# EAGLE schematic Peachy1-99-6-f (EAGLE 6.5.0)

## Sheet 1 of 4
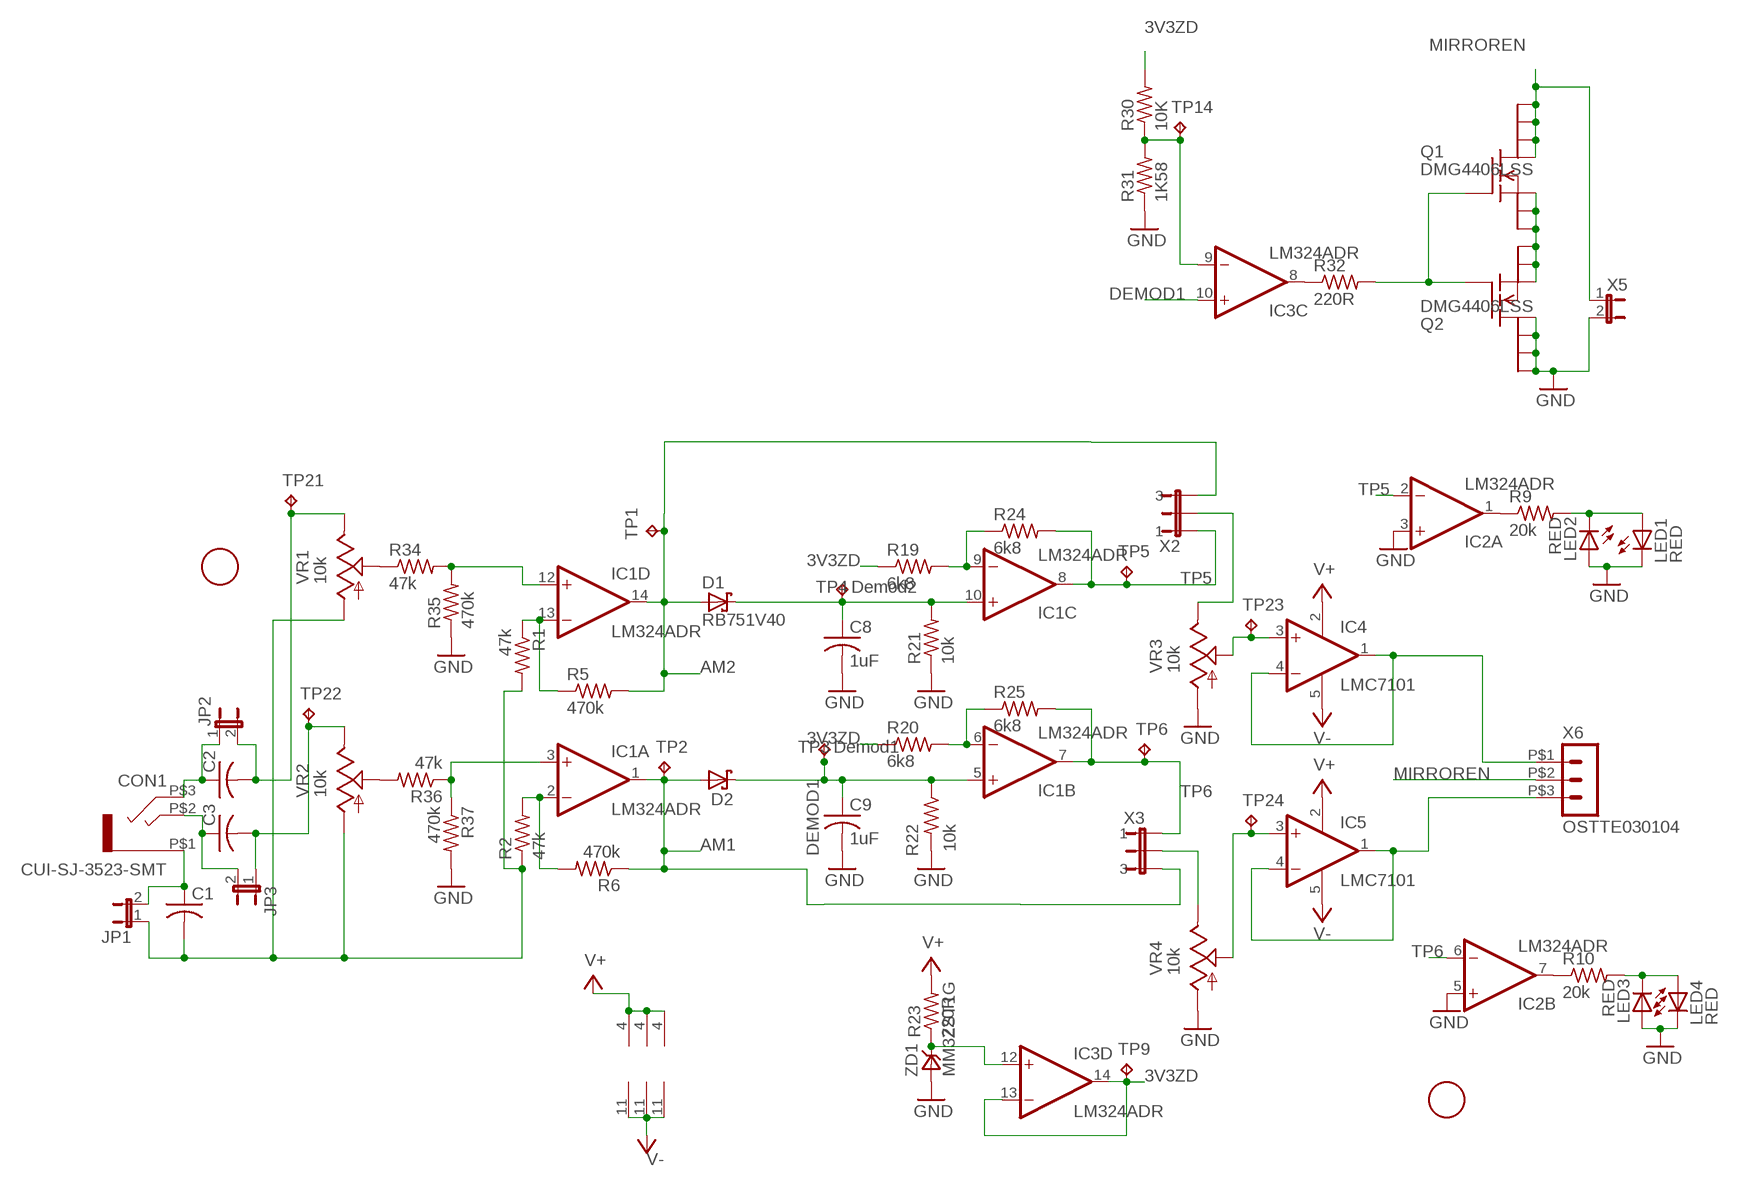
[diagram p0: schematic, sheet 1]

### Parts
C1  C-US0805  [C0805]
C2  C-US0805  [C0805]
C3  C-US0805  [C0805]
C8  1uF  C-US0805  [C0805]
C9  1uF  C-US0805  [C0805]
CON1  CUI-SJ-3523-SMT  [CUI-SJ-3523-SMT]
D1  RB751V40  [SOD323-R]
D2  RB751V40  [SOD323-R]
IC1  LM324ADR  [SOIC14(TI-PKG-D)]
IC2  LM324ADR  [SOIC14(TI-PKG-D)]
IC3  LM324ADR  [SOIC14(TI-PKG-D)]
IC4  LMC7101  [SOT23-5]
IC5  LMC7101  [SOT23-5]
JP1  JUMPER-2SMD-NC  [SJ_2S]
JP2  JUMPER-2SMD-NC  [SJ_2S]
JP3  JUMPER-2SMD-NC  [SJ_2S]
LED1  RED  LEDCHIPLED_0603  [CHIPLED_0603]
LED2  RED  LEDCHIPLED_0603  [CHIPLED_0603]
LED3  RED  LEDCHIPLED_0603  [CHIPLED_0603]
LED4  RED  LEDCHIPLED_0603  [CHIPLED_0603]
Q1  DMG4406LSS  [SO8_DMG]
Q2  DMG4406LSS  [SO8_DMG]
R1  47k  R-US_R0805  [R0805]
R2  47k  R-US_R0805  [R0805]
R5  470k  R-US_R0805  [R0805]
R6  470k  R-US_R0805  [R0805]
R9  20k  R-US_R0805  [R0805]
R10  20k  R-US_R0805  [R0805]
R19  6k8  R-US_R0805  [R0805]
R20  6k8  R-US_R0805  [R0805]
R21  10k  R-US_R0805  [R0805]
R22  10k  R-US_R0805  [R0805]
R23  220R  R-US_R0805  [R0805]
R24  6k8  R-US_R0805  [R0805]
R25  6k8  R-US_R0805  [R0805]
R30  10K  R-US_R0805  [R0805]
R31  1K58  R-US_R0805  [R0805]
R32  220R  R-US_R0805  [R0805]
R34  47k  R-US_R0805  [R0805]
R35  470k  R-US_R0805  [R0805]
R36  47k  R-US_R0805  [R0805]
R37  470k  R-US_R0805  [R0805]
TP1  TP017HOLE  [TP017TH]
TP2  TP017HOLE  [TP017TH]
TP3  TP017HOLE  [TP017TH]
TP4  TP017HOLE  [TP017TH]
TP5  TP017HOLE  [TP017TH]
TP6  TP017HOLE  [TP017TH]
TP9  TP017HOLE  [TP017TH]
TP14  TP017HOLE  [TP017TH]
TP21  TP017HOLE  [TP017TH]
TP22  TP017HOLE  [TP017TH]
TP23  TP017HOLE  [TP017TH]
TP24  TP017HOLE  [TP017TH]
U$2  FIDUCIAL  [FIDUCIAL_1MM]
U$3  FIDUCIAL  [FIDUCIAL_1MM]
VR1  10k  TRIM_US-67W  [67W]
VR2  10k  TRIM_US-67W  [67W]
VR3  10k  TRIM_US-PVZ3A  [PVZ3A]
VR4  10k  TRIM_US-PVZ3A  [PVZ3A]
X2  JUMPER-31-2  [SJ_3_PASTE1&2]
X3  JUMPER-31-2  [SJ_3_PASTE1&2]
X5  JUMPER-2SMD-NO  [SJ_2S-NO]
X6  OSTTE030104  [OSTTE030104]
ZD1  MM3ZST1G  [SOD323-R]

### Nets
3V3ZD: IC3.13(D:-IN) IC3.14(D:OUT) R19.1 R20.1 R30.2 TP9.P$1(TP) ; also sheet 3
AM1: D2.A IC1.1(A:OUT) R6.1 TP2.P$1(TP) X3.3 ; also sheet 3
AM2: D1.A IC1.14(D:OUT) R5.2 TP1.P$1(TP) X2.3
DEMOD1: C9.1 D2.C IC1.5(B:+IN) IC3.10(C:+IN) R22.1 TP3.P$1(TP)
DEMOD2: C8.1 D1.C IC1.10(C:+IN) R21.2 TP4.P$1(TP)
GND [pwr]: C8.2 C9.2 IC2.3(A:+IN) IC2.5(B:+IN) LED1.C LED2.A LED3.A LED4.C Q2.P$5(D) Q2.P$6(D) Q2.P$7(D) Q2.P$8(D) R21.1 R22.2 R31.1 R35.1 R37.2 VR3.P$1(A) VR4.P$1(A) X5.2 ZD1.A ; also sheet 2,3,4
MIRROREN [pwr]: Q1.P$5(D) Q1.P$6(D) Q1.P$7(D) Q1.P$8(D) X5.1 X6.P$2
N$3: C3.2 JP3.1 TP22.P$1(TP) VR2.E
N$4 [pwr]: C1.2 JP1.1 R1.2 R2.1 VR1.A VR2.A
N$5: R34.1 VR1.S
N$6: IC1.13(D:-IN) R1.1 R5.1
N$8: IC1.12(D:+IN) R34.2 R35.2
N$9: VR4.P$3(E) X3.2
N$10: IC3.12(D:+IN) R23.1 ZD1.C
N$12: IC1.2(A:-IN) R2.2 R6.2
N$13: IC4.3(+IN) TP23.P$1(TP) VR3.P$2(S)
N$14: R36.2 VR2.S
N$15: IC1.3(A:+IN) R36.1 R37.1
N$17: IC1.9(C:-IN) R19.2 R24.1
N$18: IC2.1(A:OUT) R9.1
N$19: IC1.6(B:-IN) R20.2 R25.1
N$20: IC2.7(B:OUT) R10.1
N$21 [pwr]: IC5.1(OUT) IC5.4(-IN) X6.P$3
N$22 [pwr]: IC4.1(OUT) IC4.4(-IN) X6.P$1
N$23: VR3.P$3(E) X2.2
N$24: IC5.3(+IN) TP24.P$1(TP) VR4.P$2(S)
N$28: Q1.P$4(G) Q2.P$4(G) R32.2
N$32: Q1.P$1(S) Q1.P$2(S) Q1.P$3(S) Q2.P$1(S) Q2.P$2(S) Q2.P$3(S)
N$38: IC3.9(C:-IN) R30.1 R31.2 TP14.P$1(TP)
N$39: LED1.A LED2.C R9.2
N$42: IC3.8(C:OUT) R32.1
N$44: LED3.C LED4.A R10.2
N$51: C1.1 CON1.P$1 JP1.2
N$52: C3.1 CON1.P$2 JP3.2
N$53: C2.1 CON1.P$3 JP2.1
N$54: C2.2 JP2.2 TP21.P$1(TP) VR1.E
TP5: IC1.8(C:OUT) IC2.2(A:-IN) R24.2 TP5.P$1(TP) X2.1
TP6: IC1.7(B:OUT) IC2.6(B:-IN) R25.2 TP6.P$1(TP) X3.1
V+: IC1.4(P:V+) IC2.4(P:V+) IC3.4(P:V+) IC4.2(V+) IC5.2(V+) R23.2 ; also sheet 2,3
V-: IC1.11(P:V-) IC2.11(P:V-) IC3.11(P:V-) IC4.5(V-) IC5.5(V-) ; also sheet 2
Unconnected: IC2.12(D:+IN) IC2.13(D:-IN) IC2.14(D:OUT)

## Sheet 2 of 4: Power Supply
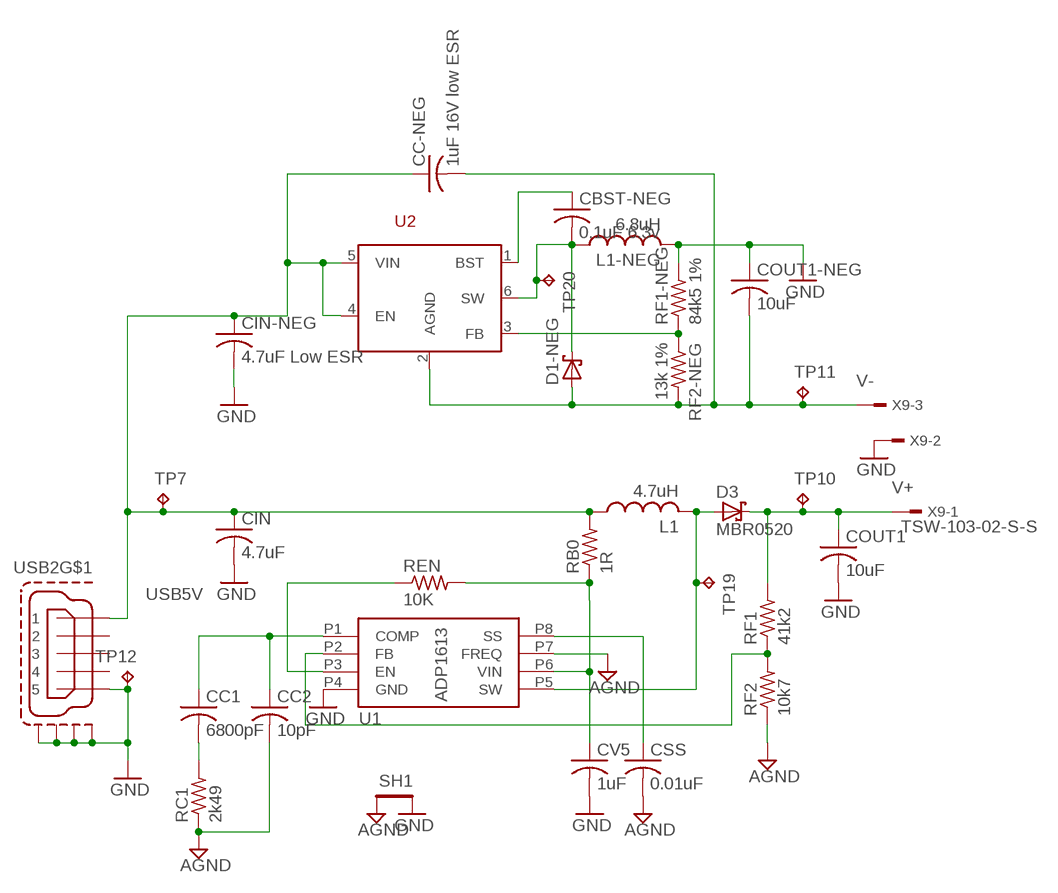
[diagram p1: schematic, sheet 2]

### Parts
CBST-NEG  0.1uF 6.3v  C-US0805  [C0805]
CC1  6800pF  C-US0805  [C0805]
CC2  10pF  C-US0805  [C0805]
CC-NEG  1uF 16V low ESR  C-US0805  [C0805]
CIN  4.7uF  C-US0805  [C0805]
CIN-NEG  4.7uF Low ESR  C-US0805  [C0805]
COUT1  10uF  C-US0805  [C0805]
COUT1-NEG  10uF  C-US0805  [C0805]
CSS  0.01uF  C-US0805  [C0805]
CV5  1uF  C-US0805  [C0805]
D1-NEG  MBR0520LT1G  SCHOTTKYSOD123  [SOD123]
D3  MBR0520  SCHOTTKYSOD123  [SOD123]
L1  4.7uH  L-USL1210  [L1210]
L1-NEG  6.8uH  L-USL1210  [L1210]
RB0  1R  R-US_R0805  [R0805]
RC1  2k49  R-US_R0805  [R0805]
REN  10K  R-US_R0805  [R0805]
RF1  41k2  R-US_R0805  [R0805]
RF1-NEG  84k5 1%  R-US_R0805  [R0805]
RF2  10k7  R-US_R0805  [R0805]
RF2-NEG  13k 1%  R-US_R0805  [R0805]
SH1  SHORT-HT5  [SHORT_TOP-50]
TP7  TP017HOLE  [TP017TH]
TP10  TP017HOLE  [TP017TH]
TP11  TP017HOLE  [TP017TH]
TP12  TP017HOLE  [TP017TH]
TP19  TP017HOLE  [TP017TH]
TP20  TP017HOLE  [TP017TH]
U1  ADP1613  [RM-8]
U2  ADP2300  [TSOT23-6]
USB2  FCI-MICROUSBAPCIRCUITS  [FCI-USB-10118193-APCIRCUITS]
X9  TSW-103-02-S-S  [TSW-103-02-S-S]

### Nets
AGND [pwr]: CC2.2 CSS.2 RC1.1 RF2.1 SH1.1 U1.P7(FREQ)
BOOST: CBST-NEG.1 U2.1(BST)
GND [pwr]: CIN-NEG.2 CIN.2 COUT1-NEG.1 COUT1.2 CV5.2 L1-NEG.2 RF1-NEG.2 SH1.2 TP12.P$1(TP) U1.P4(GND) USB2.P$5 USB2.P$6(S1) USB2.P$7(S2) USB2.P$8(S3) USB2.P$11(S4) X9.2 ; also sheet 1,3,4
N$1: CV5.1 RB0.1 REN.2 U1.P6(VIN)
N$2: REN.1 U1.P3(EN)
N$16: CSS.1 U1.P8(SS)
N$34: RF1.1 RF2.2 U1.P2(FB)
N$35: CC1.1 CC2.1 U1.P1(COMP)
N$36: CC1.2 RC1.2
N$40: RF1-NEG.1 RF2-NEG.1 U2.3(FB)
SW+: D3.A L1.2 TP19.P$1(TP) U1.P5(SW)
SW-: CBST-NEG.2 D1-NEG.C L1-NEG.1 TP20.P$1(TP) U2.6(SW)
USB5V [pwr]: CC-NEG.1 CIN-NEG.1 CIN.1 L1.1 RB0.2 TP7.P$1(TP) U2.4(EN) U2.5(VIN) USB2.P$1
V+: COUT1.1 D3.C RF1.2 TP10.P$1(TP) X9.1 ; also sheet 1,3
V-: CC-NEG.2 COUT1-NEG.2 D1-NEG.A RF2-NEG.2 TP11.P$1(TP) U2.2(AGND) X9.3 ; also sheet 1
Unconnected: USB2.P$2 USB2.P$3 USB2.P$4

## Sheet 3 of 4: Laser Control
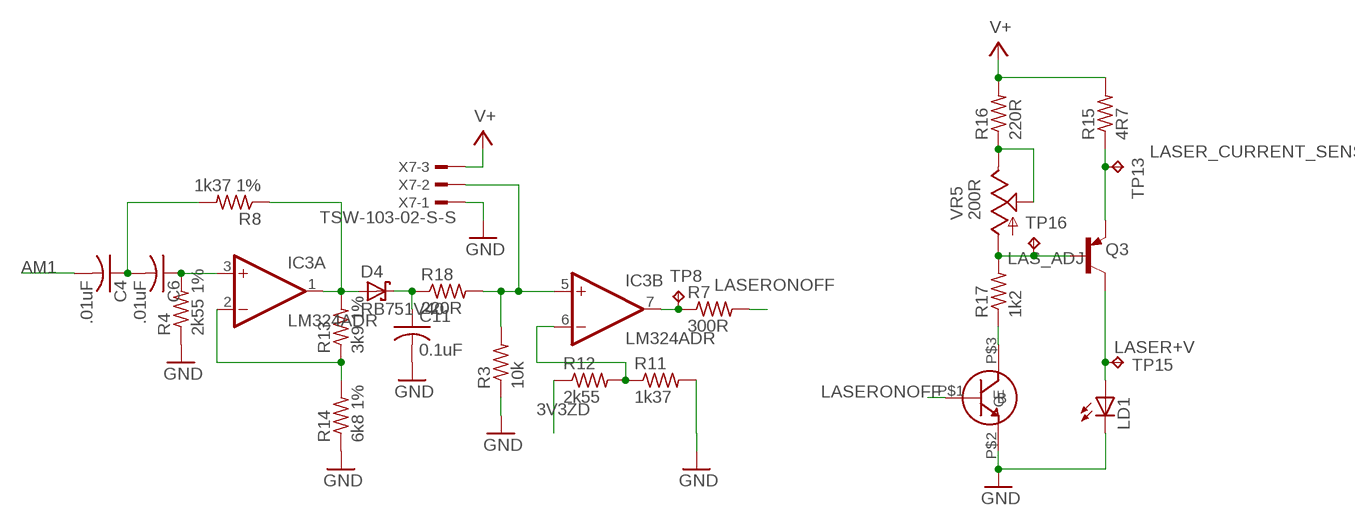
[diagram p2: schematic, sheet 3]

### Parts
C4  .01uF  C-US0805  [C0805]
C6  .01uF  C-US0805  [C0805]
C11  0.1uF  C-US0805  [C0805]
D4  RB751V40  [SOD323-R]
LD1  LASERDIODELD2  [LASERDIODE2]
Q3  BC857CT  [SC-75]
Q4  MMBT3904  [SOT23]
R3  10k  R-US_R0805  [R0805]
R4  2k55 1%  R-US_R0805  [R0805]
R7  300R  R-US_R0805  [R0805]
R8  1k37 1%  R-US_R0805  [R0805]
R11  1k37  R-US_R0805  [R0805]
R12  2k55  R-US_R0805  [R0805]
R13  3k9 1%  R-US_R0805  [R0805]
R14  6k8 1%  R-US_R0805  [R0805]
R15  4R7  R-US_R0805  [R0805]
R16  220R  R-US_R0805  [R0805]
R17  1k2  R-US_R0805  [R0805]
R18  220R  R-US_R0805  [R0805]
TP8  TP017HOLE  [TP017TH]
TP13  TP017HOLE  [TP017TH]
TP15  TP017HOLE  [TP017TH]
TP16  TP017HOLE  [TP017TH]
VR5  200R  TRIM_US-TC33X  [TC33X]
X7  TSW-103-02-S-S  [TSW-103-02-S-S]

### Nets
3V3ZD: R12.1 ; also sheet 1
AM1: C4.2 ; also sheet 1
GND [pwr]: C11.2 LD1.P$3(C) Q4.P$2(E) R3.1 R4.1 R11.2 R14.1 X7.1 ; also sheet 1,2,4
LASERONOFF: Q4.P$1(B) R7.2
N$7: IC3.5(B:+IN) R3.2 R18.2 X7.2
N$11: IC3.6(B:-IN) R11.1 R12.2
N$25: IC3.2(A:-IN) R13.1 R14.2
N$26: LD1.P$1(A) Q3.P$3(C) TP15.P$1(TP)
N$27: IC3.7(B:OUT) R7.1 TP8.P$1(TP)
N$29: C6.1 IC3.3(A:+IN) R4.2
N$30: C4.1 C6.2 R8.2
N$31: D4.A IC3.1(A:OUT) R8.1 R13.2
N$33: C11.1 D4.C R18.1
N$37: R16.1 VR5.P$2(S) VR5.P$3(E)
N$45: Q3.P$1(B) R17.2 TP16.P$1(TP) VR5.P$1(A)
N$46: Q4.P$3(C) R17.1
N$49: Q3.P$2(E) R15.1 TP13.P$1(TP)
V+: R15.2 R16.2 X7.3 ; also sheet 1,2

## Sheet 4 of 4: Depth Sensor
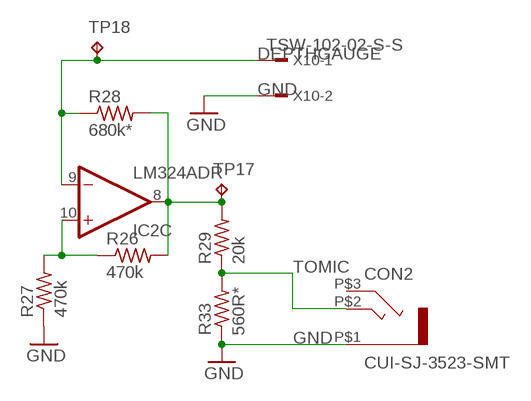
[diagram p3: schematic, sheet 4]

### Parts
CON2  CUI-SJ-3523-SMT  [CUI-SJ-3523-SMT]
R26  470k  R-US_R0805  [R0805]
R27  470k  R-US_R0805  [R0805]
R28  680k*  R-US_SOCKET(.1)  [70543-02]
R29  20k  R-US_R0805  [R0805]
R33  560R*  R-US_R0805  [R0805]
TP17  TP017HOLE  [TP017TH]
TP18  TP017HOLE  [TP017TH]
X10  TSW-102-02-S-S  [TSW-102-02-S-S]

### Nets
DEPTHGAUGE: IC2.9(C:-IN) R28.1 TP18.P$1(TP) X10.1
GND [pwr]: CON2.P$1 R27.1 R33.1 X10.2 ; also sheet 1,2,3
N$47: IC2.8(C:OUT) R26.2 R28.2 R29.2 TP17.P$1(TP)
N$48: IC2.10(C:+IN) R26.1 R27.2
TOMIC: CON2.P$2 R29.1 R33.2
Unconnected: CON2.P$3

## Library data of the parts
C1-C3 = Scott:C-US: CAPACITOR, American symbol
C4 C6 CSS = Scott:C-US: CAPACITOR, American symbol; MPN: CL21B103KBANNNC
C8 C9 CC-NEG CV5 = Scott:C-US: CAPACITOR, American symbol; MPN: CL21B105KBFNNNE
C11 CBST-NEG = Scott:C-US: CAPACITOR, American symbol; MPN: CL21B104KACNNNC
CC1 = Scott:C-US: CAPACITOR, American symbol; MPN: CL21B682KBANNNC
CC2 = Scott:C-US: CAPACITOR, American symbol; MPN: CL21C100JCANNNC
CIN CIN-NEG = Scott:C-US: CAPACITOR, American symbol; MPN: CL21A475KOFNNNE
CON1 CON2 = Scott:CUI-SJ-3523-SMT; MPN: SJ-3523-SMT-TR
COUT1 COUT1-NEG = Scott:C-US: CAPACITOR, American symbol; MPN: CL21B106KQQNNNE
D1 D2 D4 = Scott:RB751; MPN: RB751V40,115
D1-NEG D3 = Scott:SCHOTTKY; MPN: MBR0520LT3G
IC1-IC3 = Scott:LM324: OP AMP; MPN: LM324ADR
IC4 IC5 = Scott:LMC7101; MPN: LMC7101BYM5
JP1-JP3 X5 = Scott:JUMPER-2: Jumper Basic 0.1" spaced jumper. Use with breakaway headers.
L1 = Scott:L-US: INDUCTOR, American symbol; MPN: LQH32PN4R7NN0L
L1-NEG = Scott:L-US: INDUCTOR, American symbol; MPN: LQH32PN6R8NN0
LD1 = Scott:LASERDIODE; MPN: 3 x (0552-2-15-15-11-27-10-0)
LED1-LED4 = Scott:LED: LED OSRAM: - CHIPLED LG R971, LG N971, LY N971, LG Q971, LY Q971, LO R971, LY R971 LH N974, LH R974 LS Q976, LO Q976, LY Q976 LO Q996 - Hyper CHIPLED LW Q18S LB Q993, LB Q99A, LB R99A - SideLED LS A670, LO A670, LY A670, LG A670, LP A670 LB A673, LV A673, LT A673, LW A673 LH A674 LY A675 LS A676, LA A676, LO A676, LY A676, LW A676 LS A679, LY A679, LG A679 - Hyper Micro SIDELED® LS Y876, LA Y876, LO Y876, LY Y876 LT Y87S - SmartLED LW L88C, LW L88S LB L89C, LB L89S, LG L890 LS L89K, LO L89K, LY L89K LS L896, LA L896, LO L896, LY L896 - TOPLED LS T670, LO T670, LY T670, LG T670, LP T670 LSG T670, LSP T670, LSY T670, LOP T670, LYG T670 LG T671, LOG T671, LSG T671 LB T673, LV T673, LT T673, LW T673 LH T674 LS T676, LA T676, LO T676, LY T676, LB T676, LH T676, LSB T676, LW T676 LB T67C, LV T67C, LT T67C, LS T67K, LO T67K, LY T67K, LW E67C LS E67B, LA E67B, LO E67B, LY E67B, LB E67C, LV E67C, LT E67C LW T67C LS T679, LY T679, LG T679 LS T770, LO T770, LY T770, LG T770, LP T770 LB T773, LV T773, LT T773, LW T773 LH T774 LS E675, LA E675, LY E675, LS T675 LS T776, LA T776, LO T776, LY T776, LB T776 LHGB T686 LT T68C, LB T68C - Hyper Mini TOPLED® LB M676 - Mini TOPLED Santana® LG M470 LS M47K, LO M47K, LY M47K Source: http://www.osram.convergy.de LUXEON: - LUMILED® LXK2-PW12-R00, LXK2-PW12-S00, LXK2-PW14-U00, LXK2-PW14-V00 LXK2-PM12-R00, LXK2-PM12-S00, LXK2-PM14-U00 LXK2-PE12-Q00, LXK2-PE12-R00, LXK2-PE12-S00, LXK2-PE14-T00, LXK2-PE14-U00 LXK2-PB12-K00, LXK2-PB12-L00, LXK2-PB12-M00, LXK2-PB14-N00, LXK2-PB14-P00, LXK2-PB14-Q00 LXK2-PR12-L00, LXK2-PR12-M00, LXK2-PR14-Q00, LXK2-PR14-R00 LXK2-PD12-Q00, LXK2-PD12-R00, LXK2-PD12-S00 LXK2-PH12-R00, LXK2-PH12-S00 LXK2-PL12-P00, LXK2-PL12-Q00, LXK2-PL12-R00 Source: www.luxeon.com KINGBRIGHT: KA-3528ASYC Source: www.kingbright.com; MPN: LS L29K-G1J2-1-Z
Q1 Q2 = Scott:DMG4406LSS; MPN: DMG4406LSS-13
Q3 = Scott:BC857CT; MPN: BC857CT,115
Q4 = Scott:MMBT3904; MPN: MMBT3904,215
R1 R2 R34 R36 = Scott:R-US_: RESISTOR, American symbol; DIGIKEY: RMCF0805JT47K0CT-ND; MPN: RMCF0805JT47K0
R3 R21 R22 R30 REN = Scott:R-US_: RESISTOR, American symbol; MPN: RMCF0805JT10K0
R4 R12 = Scott:R-US_: RESISTOR, American symbol; MPN: RC0805FR-072K55L
R5 R6 R26 R27 R35 R37 = Scott:R-US_: RESISTOR, American symbol; MPN: RMCF0805JT470K
R7 = Scott:R-US_: RESISTOR, American symbol; MPN: RC0805JR-07300RL
R8 R11 = Scott:R-US_: RESISTOR, American symbol; MPN: RC0805FR-071K37L
R9 R10 R29 = Scott:R-US_: RESISTOR, American symbol; MPN: RMCF0805JT20K0
R13 = Scott:R-US_: RESISTOR, American symbol; MPN: RC0805FR-073K9L
R14 R19 R20 R24 R25 = Scott:R-US_: RESISTOR, American symbol; MPN: RC0805FR-076K8L
R15 = Scott:R-US_: RESISTOR, American symbol; MPN: RMCF0805JT4R70
R16 = Scott:R-US_: RESISTOR, American symbol; MPN: RC0805JR-07220RL
R17 = Scott:R-US_: RESISTOR, American symbol; MPN: RC2012J122CS
R18 R23 R32 = Scott:R-US_: RESISTOR, American symbol; MPN: RMCF0805JT220R
R28 = Scott:R-US_: RESISTOR, American symbol; MPN: PPTC021LFBN-RC
R31 = Scott:R-US_: RESISTOR, American symbol; MPN: RC0805FR-071K58L
R33 = Scott:R-US_: RESISTOR, American symbol; MPN: RMCF0805JT560R
RB0 = Scott:R-US_: RESISTOR, American symbol; MPN: RMCF0805JT1R00
RC1 = Scott:R-US_: RESISTOR, American symbol; MPN: RMCF0805FT2K49
RF1 = Scott:R-US_: RESISTOR, American symbol; MPN: RC0805FR-0741K2L
RF1-NEG = Scott:R-US_: RESISTOR, American symbol; MPN: RC0805FR-0784K5L
RF2 = Scott:R-US_: RESISTOR, American symbol; MPN: RC2012F1072CS
RF2-NEG = Scott:R-US_: RESISTOR, American symbol; MPN: RC0805FR-0713KL
SH1 = Scott:SHORT-H: Short between two nets; BOM: no
TP1 = Scott:TP: Test pad; TP_SIGNAL_NAME: Preamp2
TP2 = Scott:TP: Test pad; TP_SIGNAL_NAME: Preamp1
TP3 = Scott:TP: Test pad; TP_SIGNAL_NAME: Demod1
TP4 = Scott:TP: Test pad; TP_SIGNAL_NAME: Demod2
TP5 = Scott:TP: Test pad; TP_SIGNAL_NAME: TP5
TP6 = Scott:TP: Test pad; TP_SIGNAL_NAME: TP6
TP7-TP9 TP12 TP14 TP17 TP18 TP20-TP24 = Scott:TP: Test pad
TP10 = Scott:TP: Test pad; TP_SIGNAL_NAME: +V
TP11 = Scott:TP: Test pad; TP_SIGNAL_NAME: V-
TP13 = Scott:TP: Test pad; TP_SIGNAL_NAME: LASER_CURRENT_SENSE
TP15 = Scott:TP: Test pad; TP_SIGNAL_NAME: LASER+V
TP16 = Scott:TP: Test pad; TP_SIGNAL_NAME: LAS_ADJ
TP19 = Scott:TP: Test pad; TP_SIGNAL_NAME: SW+
U1 = Scott:ADP1613; MPN: ADP1613ARMZ-R7
U2 = Scott:ADP2300: Nonsynchronous Step-Down Regulator; MPN: ADP2300AUJZ-R7
U$2 U$3 = Scott:FIDUCIAL: For use by pick and place machines to calibrate the vision/machine, 1mm By microbuilder.eu
USB2 = Scott:FCI-MICROUSB; MPN: 10118193-0001LF
VR1 VR2 = Scott:TRIM_US-: POTENTIOMETER 3mm SMD Trimpot muRata PVZ3A/H/G (not K); MPN: 67WR10KLF
VR3 VR4 = Scott:TRIM_US-: POTENTIOMETER 3mm SMD Trimpot muRata PVZ3A/H/G (not K); MPN: PVZ3A103C01R00
VR5 = Scott:TRIM_US-: POTENTIOMETER 3mm SMD Trimpot muRata PVZ3A/H/G (not K); MPN: ???
X2 X3 = Scott:JUMPER-3
X6 = Scott:OSTTE030104; MPN: OSTTE030104; NOTE: Try 1984976
X7 X9 = Scott:TSW-103-02-S-S: THROUGH-HOLE .025" SQ POST HEADER Source: Samtec TSW.pdf; MPN: TSW-103-07-T-S; OC_FARNELL: unknown; OC_NEWARK: unknown
X10 = Scott:TSW-102-02-S-S: THROUGH-HOLE .025" SQ POST HEADER Source: Samtec TSW.pdf; OC_FARNELL: unknown; OC_NEWARK: unknown
ZD1 = Scott:MM3Z; MPN: BZX384-B3V3,115

## Net classes
0 default: width 0.254 mm, drill 0.432 mm, clearance 0.203 mm
1 pwr: width 0.305 mm, drill 0.432 mm, clearance 0.203 mm